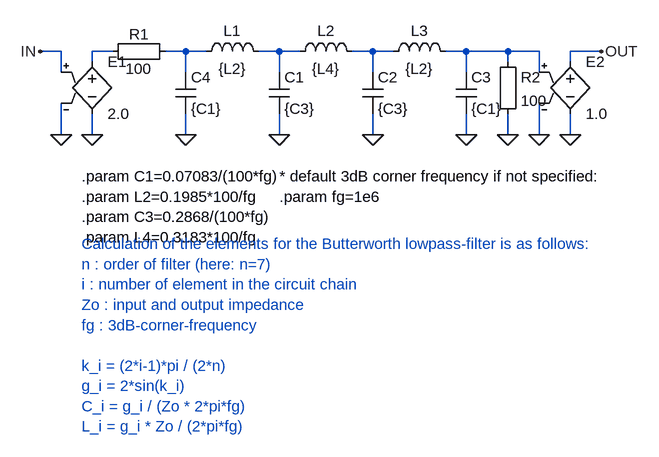
[diagram p0: schematic butterworth-lpf-7.asc]
butterworth-lpf-7.asc, the LTspice schematic file:
Version 4
SHEET 1 880 680
WIRE -304 160 -336 160
WIRE -304 192 -304 160
WIRE -304 288 -304 240
WIRE -256 176 -256 160
WIRE -256 288 -256 256
WIRE -224 160 -256 160
WIRE -112 160 -144 160
WIRE -112 192 -112 160
WIRE -112 288 -112 256
WIRE -80 160 -112 160
WIRE 32 160 0 160
WIRE 32 192 32 160
WIRE 32 288 32 256
WIRE 64 160 32 160
WIRE 176 160 144 160
WIRE 176 192 176 160
WIRE 176 288 176 256
WIRE 208 160 176 160
WIRE 320 160 288 160
WIRE 320 192 320 160
WIRE 320 288 320 256
WIRE 384 160 320 160
WIRE 384 176 384 160
WIRE 384 288 384 256
WIRE 432 160 384 160
WIRE 432 192 432 160
WIRE 432 288 432 240
WIRE 480 176 480 160
WIRE 480 288 480 256
WIRE 528 160 480 160
FLAG -112 288 0
FLAG 32 288 0
FLAG 176 288 0
FLAG 320 288 0
FLAG -336 160 IN
FLAG 528 160 OUT
FLAG 384 288 0
FLAG 480 288 0
FLAG -256 288 0
FLAG 432 288 0
FLAG -304 288 0
SYMBOL ind -96 176 R270
WINDOW 0 32 56 VTop 0
WINDOW 3 5 56 VBottom 0
SYMATTR InstName L1
SYMATTR Value {L2}
SYMBOL ind 48 176 R270
WINDOW 0 32 56 VTop 0
WINDOW 3 5 56 VBottom 0
SYMATTR InstName L2
SYMATTR Value {L4}
SYMBOL ind 192 176 R270
WINDOW 0 32 56 VTop 0
WINDOW 3 5 56 VBottom 0
SYMATTR InstName L3
SYMATTR Value {L2}
SYMBOL cap 16 192 R0
SYMATTR InstName C1
SYMATTR Value {C3}
SYMBOL cap 160 192 R0
SYMATTR InstName C2
SYMATTR Value {C3}
SYMBOL cap 304 192 R0
SYMATTR InstName C3
SYMATTR Value {C1}
SYMBOL cap -128 192 R0
SYMATTR InstName C4
SYMATTR Value {C1}
SYMBOL e -256 160 R0
SYMATTR InstName E1
SYMATTR Value 2.0
SYMBOL e 480 160 R0
SYMATTR InstName E2
SYMATTR Value 1.0
SYMBOL Misc\\EuropeanResistor -240 176 R270
WINDOW 0 27 56 VTop 0
WINDOW 3 5 56 VBottom 0
SYMATTR InstName R1
SYMATTR Value 100
SYMBOL Misc\\EuropeanResistor 368 160 R0
SYMATTR InstName R2
SYMATTR Value 100
TEXT -272 352 Left 0 !.param C1=0.07083/(100*fg)\n.param L2=0.1985*100/fg\n.param C3=0.2868/(100*fg)\n.param L4=0.3183*100/fg
TEXT 32 352 Left 0 !* default 3dB corner frequency if not specified:\n.param fg=1e6
TEXT -272 456 Left 0 ;Calculation of the elements for the Butterworth lowpass-filter is as follows:\nn : order of filter (here: n=7)\ni : number of element in the circuit chain\nZo : input and output impedance\nfg : 3dB-corner-frequency\n \nk_i = (2*i-1)*pi / (2*n)\ng_i = 2*sin(k_i)\nC_i = g_i / (Zo * 2*pi*fg)\nL_i = g_i * Zo / (2*pi*fg)

The netlist it stands for:
* butterworth-lpf-7.asc
L1 N002 N003 {L2}
L2 N003 N004 {L4}
L3 N004 N005 {L2}
C1 N003 0 {C3}
C2 N004 0 {C3}
C3 N005 0 {C1}
C4 N002 0 {C1}
E1 N001 0 IN 0 2.0
E2 OUT 0 N005 0 1.0
R1 N001 N002 100
R2 N005 0 100
.param C1=0.07083/(100*fg)
.param L2=0.1985*100/fg
.param C3=0.2868/(100*fg)
.param L4=0.3183*100/fg
* default 3dB corner frequency if not specified:
.param fg=1e6
* Calculation of the elements for the Butterworth lowpass-filter is as follows:
* n : order of filter (here: n=7)
* i : number of element in the circuit chain
* Zo : input and output impedance
* fg : 3dB-corner-frequency
* k_i = (2*i-1)*pi / (2*n)
* g_i = 2*sin(k_i)
* C_i = g_i / (Zo * 2*pi*fg)
* L_i = g_i * Zo / (2*pi*fg)
.backanno
.end